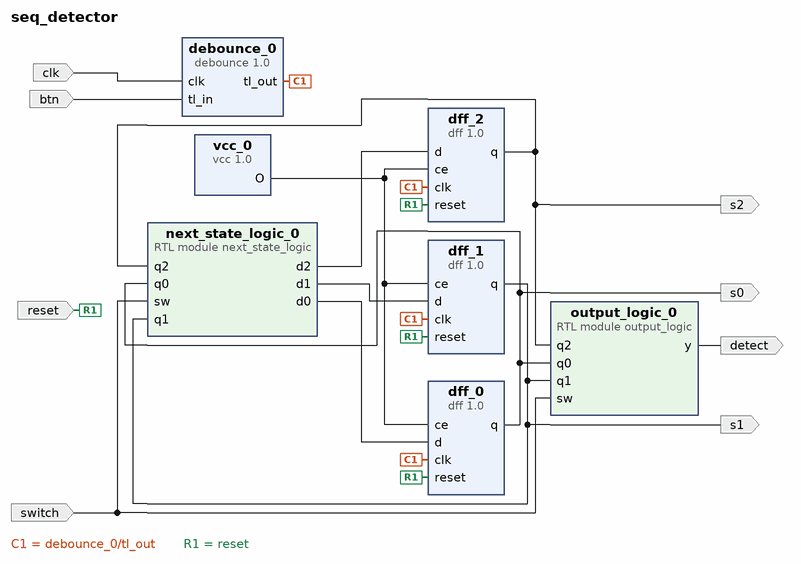
[diagram p0: block diagram of the top level]
# Vivado block design seq_detector, xc7a12ticsg325-1L, Vivado 2018.2
create_bd_design seq_detector

create_bd_port -dir I reset
create_bd_port -dir I switch
create_bd_port -dir O s0
create_bd_port -dir O s1
create_bd_port -dir O s2
create_bd_port -dir O detect
create_bd_port -dir I clk
create_bd_port -dir I btn

create_bd_cell -type module -reference next_state_logic next_state_logic_0
create_bd_cell -type module -reference output_logic output_logic_0
create_bd_cell -type ip -vlnv FIT:user:dff:1.0 dff_0
create_bd_cell -type ip -vlnv FIT:user:dff:1.0 dff_1
create_bd_cell -type ip -vlnv FIT:user:dff:1.0 dff_2
create_bd_cell -type ip -vlnv FIT:user:debounce:1.0 debounce_0
create_bd_cell -type ip -vlnv FIT:user:vcc:1.0 vcc_0

# ---- connections ----

connect_bd_net [get_bd_pins dff_0/q] [get_bd_pins output_logic_0/q0] [get_bd_pins next_state_logic_0/q0] [get_bd_ports s0]
connect_bd_net [get_bd_pins dff_1/q] [get_bd_pins output_logic_0/q1] [get_bd_pins next_state_logic_0/q1] [get_bd_ports s1]
connect_bd_net [get_bd_pins dff_2/q] [get_bd_pins output_logic_0/q2] [get_bd_pins next_state_logic_0/q2] [get_bd_ports s2]
connect_bd_net [get_bd_pins vcc_0/O] [get_bd_pins dff_2/ce] [get_bd_pins dff_1/ce] [get_bd_pins dff_0/ce]
connect_bd_net [get_bd_pins next_state_logic_0/d1] [get_bd_pins dff_1/d]
connect_bd_net [get_bd_pins next_state_logic_0/d2] [get_bd_pins dff_2/d]
connect_bd_net [get_bd_pins next_state_logic_0/d0] [get_bd_pins dff_0/d]
connect_bd_net [get_bd_pins debounce_0/tl_out] [get_bd_pins dff_1/clk] [get_bd_pins dff_2/clk] [get_bd_pins dff_0/clk]
connect_bd_net -net reset_0_1 [get_bd_ports reset] [get_bd_pins dff_0/reset] [get_bd_pins dff_1/reset] [get_bd_pins dff_2/reset]
connect_bd_net -net sw_0_1 [get_bd_ports switch] [get_bd_pins next_state_logic_0/sw] [get_bd_pins output_logic_0/sw]
connect_bd_net [get_bd_pins output_logic_0/y] [get_bd_ports detect]
connect_bd_net -net clk_0_1 [get_bd_ports clk] [get_bd_pins debounce_0/clk]
connect_bd_net -net tl_in_0_1 [get_bd_ports btn] [get_bd_pins debounce_0/tl_in]

validate_bd_design
save_bd_design
